# EAGLE schematic motors_ctrl (EAGLE 5.10)
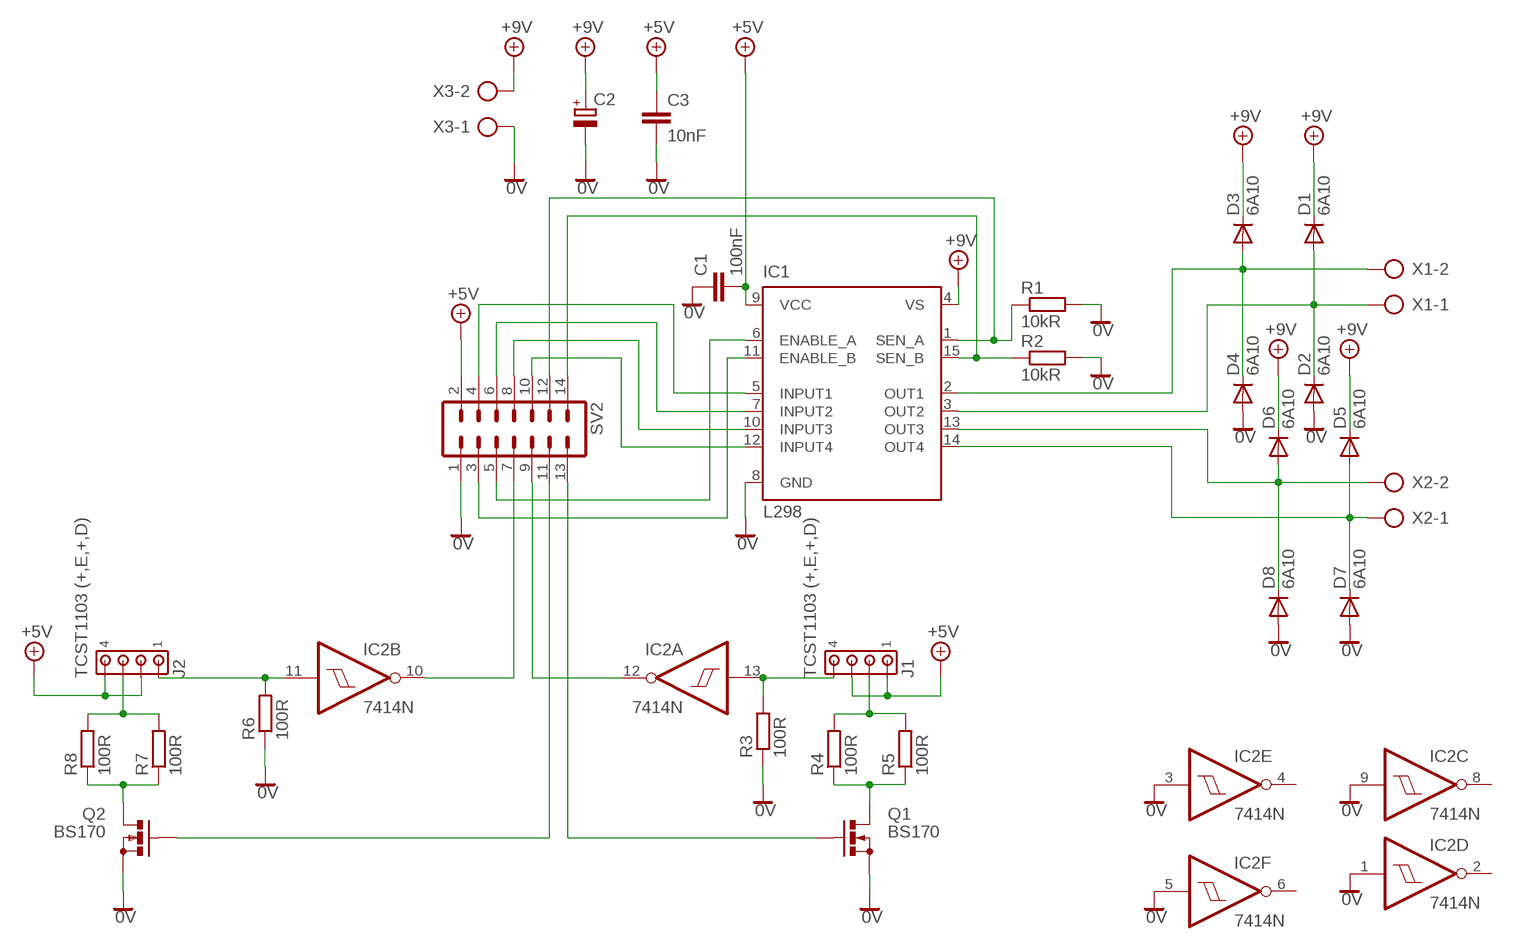
[diagram p0: schematic, sheet 1]

## Parts
C1  100nF  C-EU050-025X075  [C050-025X075]
C2  CPOL-EUE7.5-18  [E7,5-18]
C3  10nF  C-EU050-025X075  [C050-025X075]
D1  6A10  UF5400  [DO201-15]
D2  6A10  UF5400  [DO201-15]
D3  6A10  UF5400  [DO201-15]
D4  6A10  UF5400  [DO201-15]
D5  6A10  UF5400  [DO201-15]
D6  6A10  UF5400  [DO201-15]
D7  6A10  UF5400  [DO201-15]
D8  6A10  UF5400  [DO201-15]
IC1  L298  [MULTIWATT-15]
IC2  7414N  [DIL14]
J1  TCST1103 (+,E,+,D)  1445055-4  [1445055-4]
J2  TCST1103 (+,E,+,D)  1445055-4  [1445055-4]
Q1  BS170  [SOT54E]
Q2  BS170  [SOT54E]
R1  10kR  R-EU_0207/12  [0207/12]
R2  10kR  R-EU_0207/12  [0207/12]
R3  100R  R-EU_0207/12  [0207/12]
R4  100R  R-EU_0207/12  [0207/12]
R5  100R  R-EU_0207/12  [0207/12]
R6  100R  R-EU_0207/12  [0207/12]
R7  100R  R-EU_0207/12  [0207/12]
R8  100R  R-EU_0207/12  [0207/12]
SV2  ML14  [ML14]
X1  AK300/2  [AK300/2]
X2  AK300/2  [AK300/2]
X3  AK300/2  [AK300/2]

## Nets
0V: C1.1 C2.- C3.2 D2.A D4.A D7.A D8.A IC1.8(GND) IC2.1(D:I) IC2.3(E:I) IC2.5(F:I) IC2.9(C:I) Q1.S Q2.S R1.2 R2.2 R3.1 R6.1 SV2.1 X3.1
+5V: C1.2 C3.1 IC1.9(VCC) J1.1 J1.3 J2.2 J2.4 SV2.2
+9V: C2.+ D1.C D3.C D5.C D6.C IC1.4(VS) X3.2
N$1: D1.A D2.C IC1.3(OUT2) X1.1
N$2: D3.A D4.C IC1.2(OUT1) X1.2
N$3: D6.A D8.C IC1.13(OUT3) X2.2
N$4: D5.A D7.C IC1.14(OUT4) X2.1
N$5: IC1.15(SEN_B) R2.1 SV2.14
N$6: IC1.1(SEN_A) R1.1 SV2.12
N$7: IC1.12(INPUT4) SV2.10
N$8: IC1.10(INPUT3) SV2.8
N$9: IC1.7(INPUT2) SV2.6
N$10: IC1.5(INPUT1) SV2.4
N$11: IC1.6(ENABLE_A) SV2.5
N$12: IC1.11(ENABLE_B) SV2.3
N$13: Q1.G SV2.13
N$14: IC2.13(A:I) J1.4 R3.2
N$15: J1.2 R4.2 R5.2
N$16: Q1.D R4.1 R5.1
N$17: IC2.12(A:O) SV2.9
N$18: IC2.11(B:I) J2.1 R6.2
N$20: J2.3 R7.2 R8.2
N$21: Q2.D R7.1 R8.1
N$22: Q2.G SV2.11
N$23: IC2.10(B:O) SV2.7
Unconnected: IC2.2(D:O) IC2.4(E:O) IC2.6(F:O) IC2.8(C:O)

## Power pins joined to a net without a drawn wire
GND: IC2.7(P:GND)
VCC: IC2.14(P:VCC)

## Library data of the parts
C1 C3 = rcl:C-EU: CAPACITOR, European symbol
C2 = rcl:CPOL-EU: POLARIZED CAPACITOR, European symbol
D1-D8 = diode:UF5400: DIODE ultra fast rectifier, 3 A
IC1 = st-microelectronics:L298: DUAL FULL-BRIDGE DRIVER
IC2 = 74xx-eu:74*14: Hex schmitt trigger INVERTER
J1 J2 = con-amp:1445055-4: Micro MATE-N-LOK Connectors grid 1.5 mm Source: ENG_CD_1445055_A.pdf
Q1 Q2 = transistor-small-signal:BS170: N-CHANNEL MOS FET
R1-R8 = rcl:R-EU_: RESISTOR, European symbol
SV2 = con-harting-ml:ML14: HARTING
X1-X3 = con-ptr500:AK300/2: CONNECTOR